# Altium schematic sheet Schematic_st500E.schdoc
size 265 x 129 mm
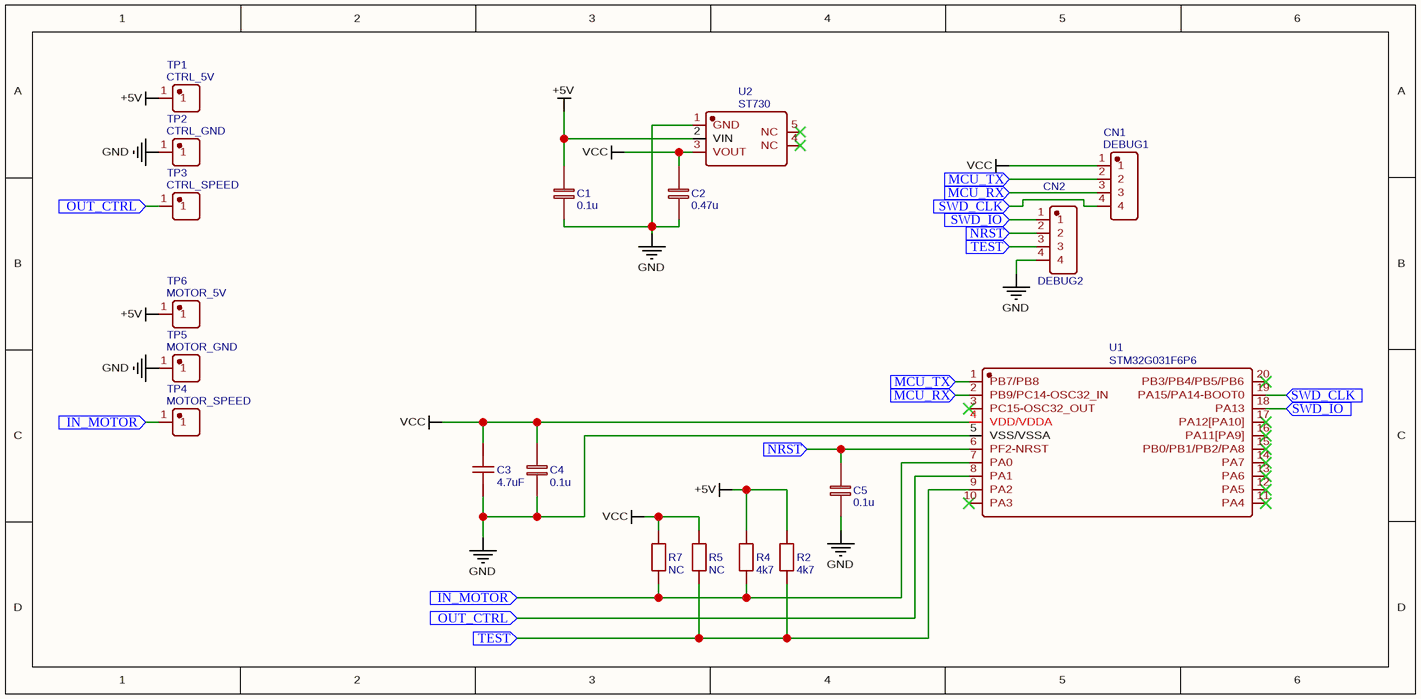
[diagram p0: Schematic_st500E.schdoc]

## Parts
C1  0.1u  [C0402]
C2  0.47u  [C0402]
C3  4.7uF  [C0805]
C4  0.1u  [C0402]
C5  0.1u  [C0402]
CN1  DEBUG1  [CONN-SMD_1125-1104G0Z135CR01]
CN2  DEBUG2  [CONN-SMD_1125-1104G0Z135CR01]
R2  4k7  [R0402]
R4  4k7  [R0402]
R5  NC  [R0402]
R7  NC  [R0402]
TP1  CTRL_5V  [TESTPOINT-SMD_L1.6-W0.8_RCU-0C]
TP2  CTRL_GND  [TESTPOINT-SMD_L1.6-W0.8_RCU-0C]
TP3  CTRL_SPEED  [TESTPOINT-SMD_L1.6-W0.8_RCU-0C]
TP4  MOTOR_SPEED  [TESTPOINT-SMD_L1.6-W0.8_RCU-0C]
TP5  MOTOR_GND  [TESTPOINT-SMD_L1.6-W0.8_RCU-0C]
TP6  MOTOR_5V  [TESTPOINT-SMD_L1.6-W0.8_RCU-0C]
U1  STM32G031F6P6  [TSSOP-20_L6.5-W4.4-P0.65-LS6.4-BL]
U2  ST730  [SOT-23-5_L2.9-W1.6-P0.95-LS2.8-BL]

## Ports
IN_MOTOR (in), MCU_RX (in), MCU_TX (in), NRST (in), OUT_CTRL (in), SWD_CLK (in), SWD_IO (in), TEST (in)

## Nets
+5V: C1.2 R2.2 R4.2 TP1.1 TP6.1 U2.2(VIN)
GND: C1.1 C2.1 C3.1 C4.1 C5.1 CN2.4 TP2.1 TP5.1 U1.5(VSS/VSSA) U2.1(GND)
VCC: C2.2 C3.2 C4.2 CN1.1 R5.2 R7.2 U1.4(VDD/VDDA) U2.3(VOUT)
IN_MOTOR: R4.1 R7.1 TP4.1 U1.7(PA0) ; port IN_MOTOR
MCU_RX: CN1.3 U1.2(PB9/PC14-OSC32_IN) ; port MCU_RX
MCU_TX: CN1.2 U1.1(PB7/PB8) ; port MCU_TX
NRST: C5.2 CN2.2 U1.6(PF2-NRST) ; port NRST
OUT_CTRL: TP3.1 U1.8(PA1) ; port OUT_CTRL
SWD_CLK: CN1.4 U1.19(PA15/PA14-BOOT0) ; port SWD_CLK
SWD_IO: CN2.1 U1.18(PA13) ; port SWD_IO
TEST: CN2.3 R2.1 R5.1 U1.9(PA2) ; port TEST

Not connected (* = marked no-connect by the designer): U1 3(PC15-OSC32_OUT)* 10(PA3)* 11(PA4)* 12(PA5)* 13(PA6)* 14(PA7)* 15(PB0/PB1/PB2/PA8)* 16(PA11[PA9])* 17(PA12[PA10])* 20(PB3/PB4/PB5/PB6)*; U2 4(NC)* 5(NC)*

## Library data of the parts
C1 C4 C5 = 0.1u: nameAlias: Value(F); Contributor: LCEDA_Lib; spicePre: C; spiceSymbolName: C_0402_EU
C2 = 0.47u: nameAlias: Value(F); Contributor: LCEDA_Lib; BOM_Supplier: LCSC; spicePre: C; spiceSymbolName: C_0402_EU
C3 = 4.7uF: BOM_Manufacturer: Kyocera AVX; BOM_Manufacturer Part: 1206YG475ZAT2A; nameAlias: Capacitance; Contributor: LCSC; BOM_Supplier: LCSC; BOM_Supplier Part: C597548; BOM_JLCPCB Part Class: Extended Part; spicePre: C; spiceSymbolName: 1206YG475ZAT2A
CN1 = DEBUG1: BOM_Manufacturer: Wcon(维峰电子); BOM_Manufacturer Part: 1125-1104G0Z135CR01; Contributor: LCSC; BOM_Supplier: LCSC; BOM_Supplier Part: C721862; BOM_JLCPCB Part Class: Extended Part; spicePre: C; spiceSymbolName: 1125-1104G0Z135CR01
CN2 = DEBUG2: BOM_Manufacturer: Wcon(维峰电子); BOM_Manufacturer Part: 1125-1104G0Z135CR01; Contributor: LCSC; BOM_Supplier: LCSC; BOM_Supplier Part: C721862; BOM_JLCPCB Part Class: Extended Part; spicePre: C; spiceSymbolName: 1125-1104G0Z135CR01
R2 R4 = 4k7: nameAlias: Value(Ω); Contributor: LCEDA_Lib; spicePre: R; spiceSymbolName: R_0402_EU
R5 R7 = NC: nameAlias: Value(Ω); Contributor: LCEDA_Lib; spicePre: R; spiceSymbolName: R_0402_EU
TP1 = CTRL_5V: BOM_Manufacturer: null; BOM_Manufacturer Part: RCU-0C; Contributor: lcsc; BOM_Supplier: LCSC; BOM_Supplier Part: C9900019498; BOM_JLCPCB Part Class: Extended Part; spicePre: T; spiceSymbolName: RCU-0C
TP2 = CTRL_GND: BOM_Manufacturer: null; BOM_Manufacturer Part: RCU-0C; Contributor: lcsc; BOM_Supplier: LCSC; BOM_Supplier Part: C9900019498; BOM_JLCPCB Part Class: Extended Part; spicePre: T; spiceSymbolName: RCU-0C
TP3 = CTRL_SPEED: BOM_Manufacturer: null; BOM_Manufacturer Part: RCU-0C; Contributor: lcsc; BOM_Supplier: LCSC; BOM_Supplier Part: C9900019498; BOM_JLCPCB Part Class: Extended Part; spicePre: T; spiceSymbolName: RCU-0C
TP4 = MOTOR_SPEED: BOM_Manufacturer: null; BOM_Manufacturer Part: RCU-0C; Contributor: lcsc; BOM_Supplier: LCSC; BOM_Supplier Part: C9900019498; BOM_JLCPCB Part Class: Extended Part; spicePre: T; spiceSymbolName: RCU-0C
TP5 = MOTOR_GND: BOM_Manufacturer: null; BOM_Manufacturer Part: RCU-0C; Contributor: lcsc; BOM_Supplier: LCSC; BOM_Supplier Part: C9900019498; BOM_JLCPCB Part Class: Extended Part; spicePre: T; spiceSymbolName: RCU-0C
TP6 = MOTOR_5V: BOM_Manufacturer: null; BOM_Manufacturer Part: RCU-0C; Contributor: lcsc; BOM_Supplier: LCSC; BOM_Supplier Part: C9900019498; BOM_JLCPCB Part Class: Extended Part; spicePre: T; spiceSymbolName: RCU-0C
U1 = STM32G031F6P6: BOM_Manufacturer: ST(意法半导体); Contributor: LCSC; BOM_Supplier: LCSC; BOM_Supplier Part: C529333; BOM_Manufacturer Part: STM32G031F6P6; BOM_JLCPCB Part Class: Extended Part; spicePre: U; spiceSymbolName: STM32G031F6P6
U2 = ST730: BOM_Manufacturer: null; BOM_Manufacturer Part: SMDSOT23-5LN6210B332MR-G; Contributor: LCSC; BOM_Supplier: LCSC; BOM_Supplier Part: C9900003457; BOM_JLCPCB Part Class: Extended Part; spicePre: U; spiceSymbolName: SMDSOT23-5LN6210B332MR-G